# Altium schematic sheet HKCV4.SchDoc
size 459 x 271 mm; Origin: Eagle; OriginPath: \\wsl.localhost\Ubuntu-24.04\home\jverga\Helium_Electronics\3phase_integrated-master\New Version\Cheetah Driver Integrated V4\HKCV4.sch; OriginSheet: 1
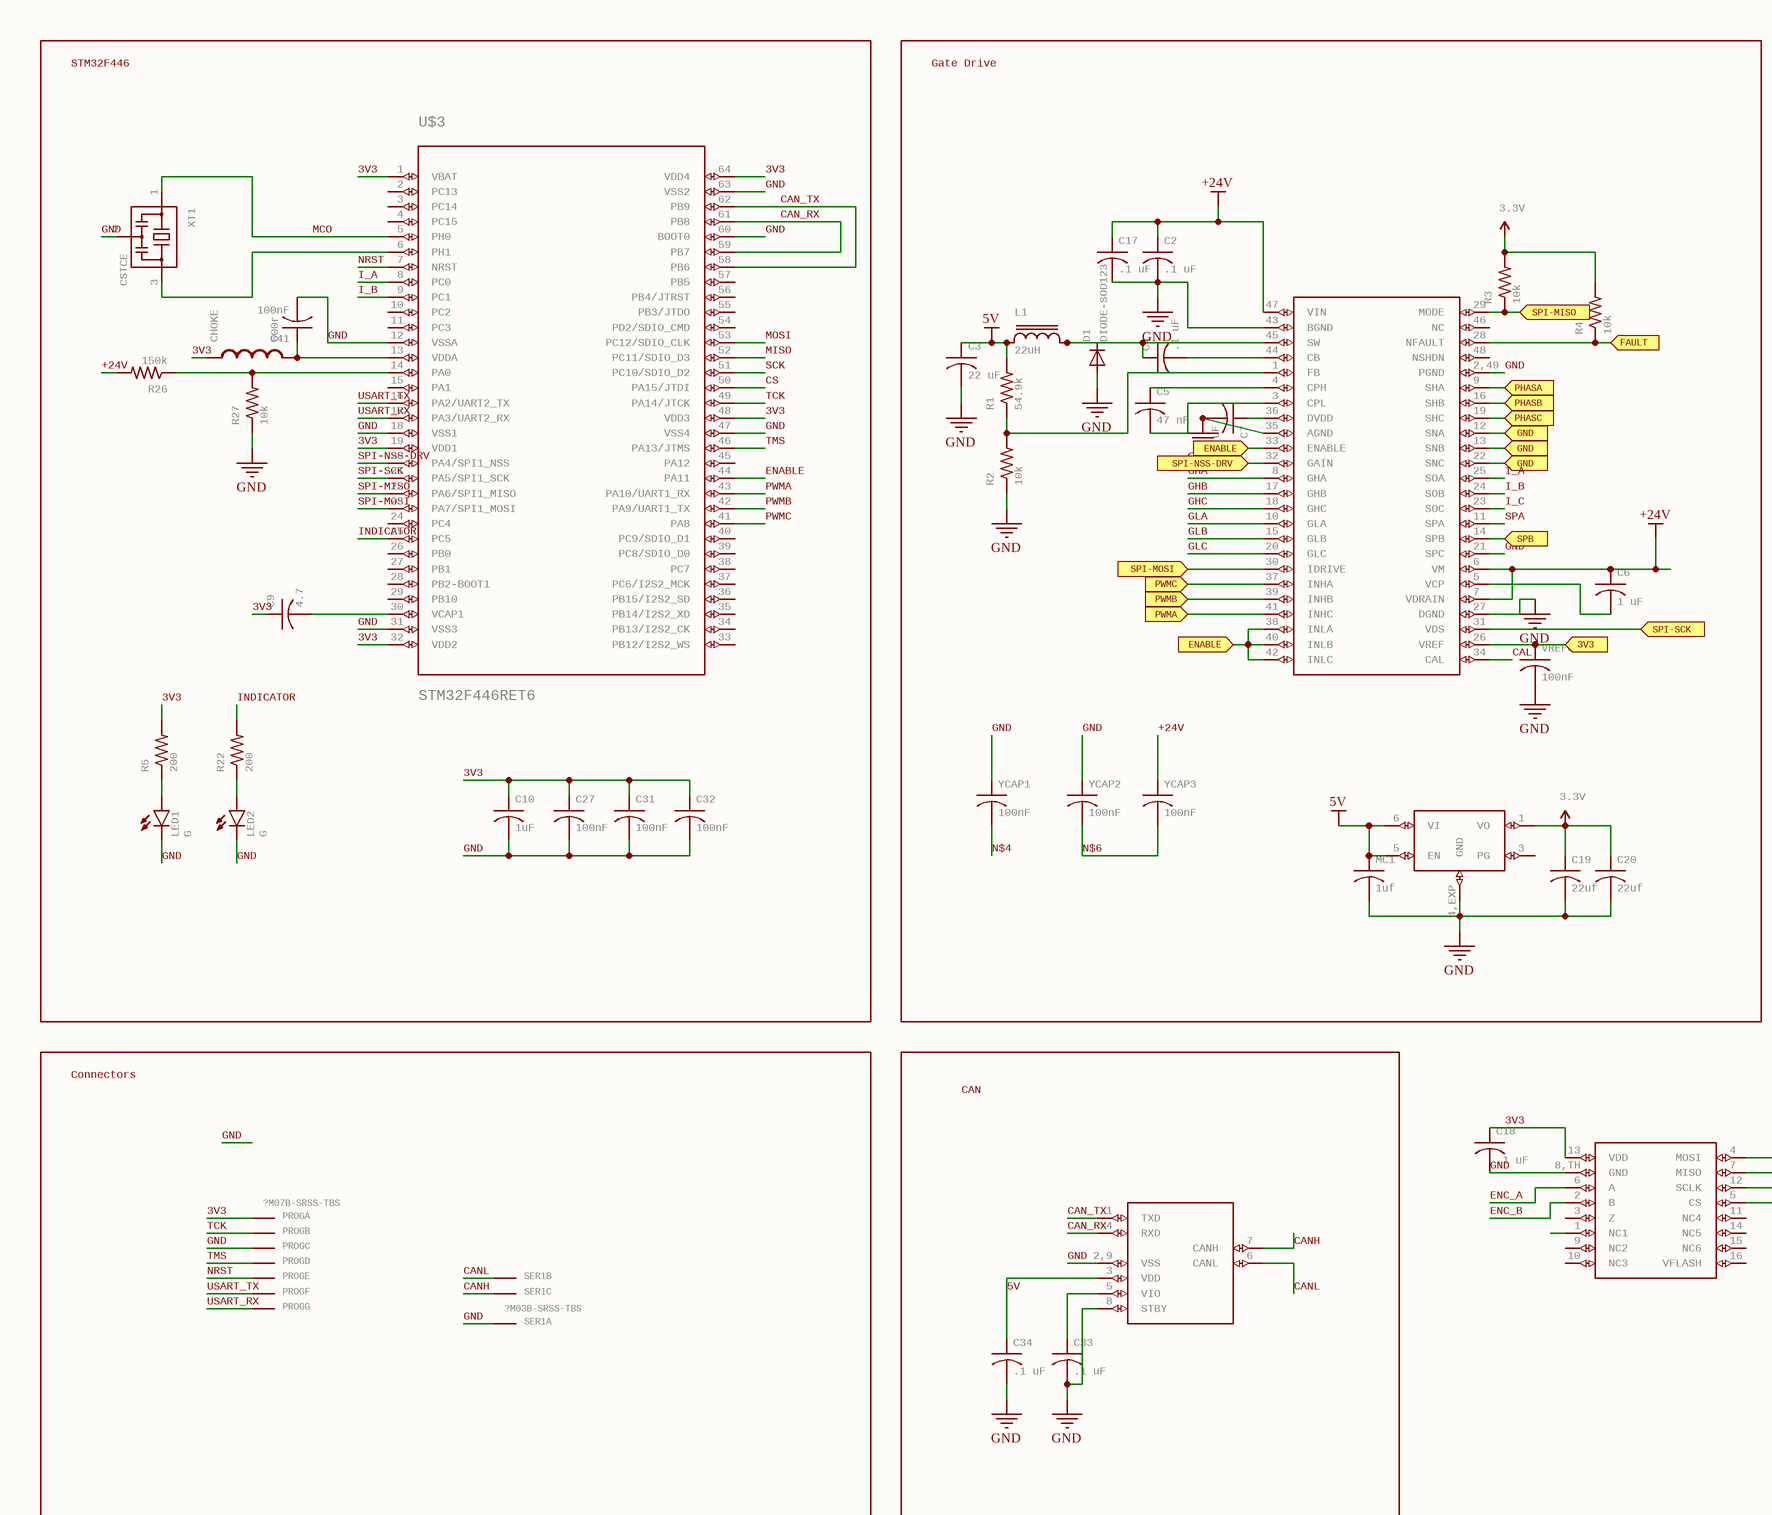
[diagram p0: HKCV4.SchDoc, left]
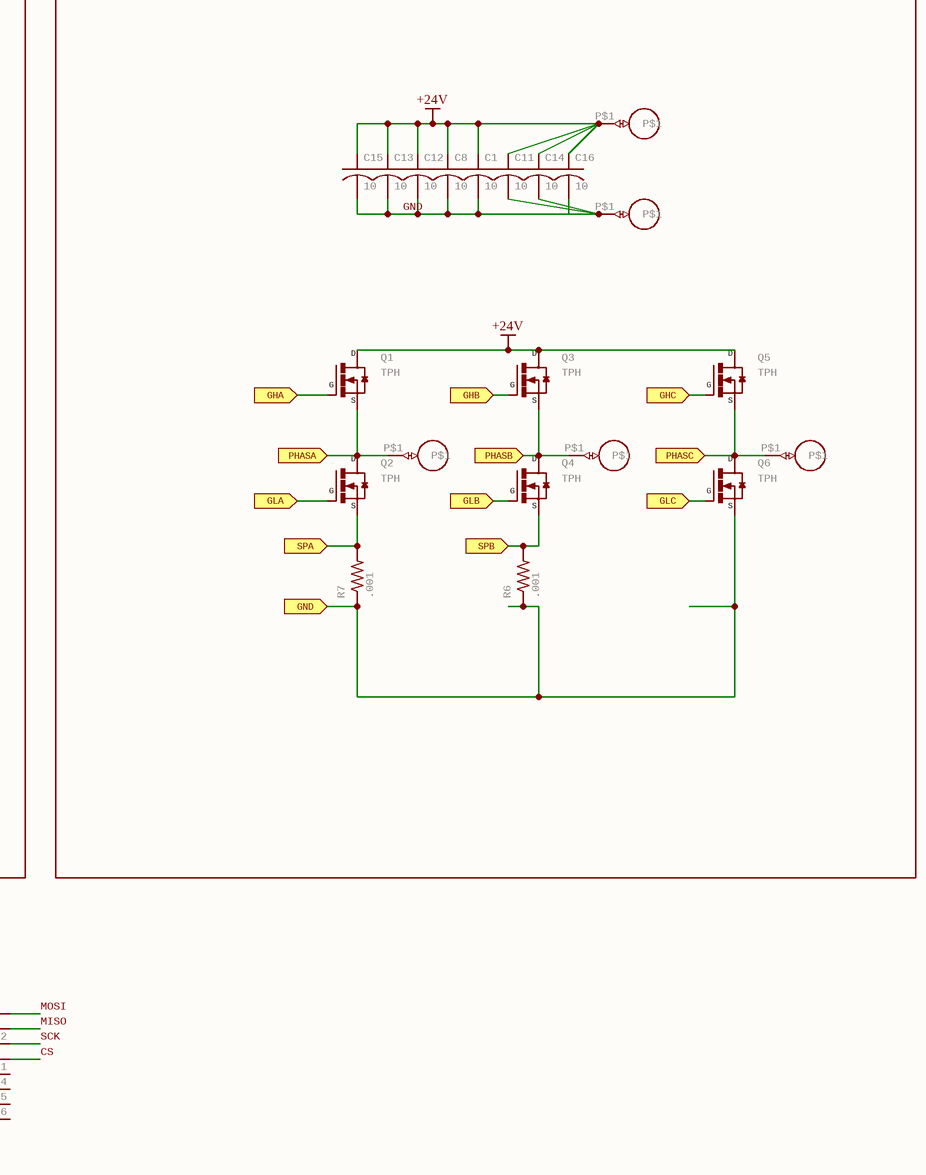
[diagram p1: HKCV4.SchDoc, right]

## Parts
C1  10  [C1206K]
C2  .1 uF  [C0603K]
C3  22 uF  [C0603K]
C4  .1 uF  [C0603K]
C5  47 nF  [C0402K]
C6  1 uF  [C0603K]
C7  1 uF  [C0402K]
C8  10  [C1206K]
C9  4.7  [C0402K]
C10  1uF  [C0402K]
C11  10  [C1206K]
C12  10  [C1206K]
C13  10  [C1206K]
C14  10  [C1206K]
C15  10  [C1206K]
C16  10  [C1206K]
C17  .1 uF  [C1206K]
C18  .1 uF  [C0402K]
C19  22uf  [C0603K]
C20  22uf  [C0603K]
C27  100nF  [C0402K]
C31  100nF  [C0402K]
C32  100nF  [C0402K]
C33  .1 uF  [C0402K]
C34  .1 uF  [C0402K]
C41  100nF  [C0402]
CHOKE  600r  [0603]
D1  DIODE-SOD123  [SOD123]
L1  22uH  [SDR0302]
LED1  G  [LED-0603]
LED2  G  [LED-0603]
MC1  1uf  [C0402]
PROG  ?M07B-SRSS-TBS  [SM07B-SRSS-TB]  (parts A,B,C,D,E,F,G of 7)
Q1  TPH  [TRANS_TPH5900CNH,L1Q]
Q2  TPH  [TRANS_TPH5900CNH,L1Q]
Q3  TPH  [TRANS_TPH5900CNH,L1Q]
Q4  TPH  [TRANS_TPH5900CNH,L1Q]
Q5  TPH  [TRANS_TPH5900CNH,L1Q]
Q6  TPH  [TRANS_TPH5900CNH,L1Q]
R1  54.9k  [R0402]
R2  10k  [R0402]
R3  10k  [R0402]
R4  10k  [R0402]
R5  200  [R0402]
R6  .001  [R1210]
R7  .001  [R1210]
R22  200  [R0402]
R26  150k  [R0402]
R27  10k  [R0402]
SER1  ?M03B-SRSS-TBS  [SM03B-SRSS-TB]  (parts A,B,C of 3)
SUPPLY1  3.3V
SUPPLY2  3.3V
U$1  DRV8323RH  [QFN50P700X700X90-49N]  (value not drawn)
U$2  18_AWG_PAD  [18_AWG_PAD]  (value not drawn)
U$3  STM32F446RET6  [TQFP64]
U$4  18_AWG_PAD  [18_AWG_PAD]  (value not drawn)
U$5  18_AWG_PAD  [18_AWG_PAD]  (value not drawn)
U$6  MCP2542  [TDFN]  (value not drawn)
U$7  LDFM  [DFN6-3X3]  (value not drawn)
U$8  18_AWG_PAD  [18_AWG_PAD]  (value not drawn)
U$10  18_AWG_PAD  [18_AWG_PAD]  (value not drawn)
U$11  MA700  [QFN16]  (value not drawn)
VREFCAP  100nF  [C0402K]
XT1  CSTCE  [CSTCE]
YCAP1  100nF  [C0402K]
YCAP2  100nF  [C0402K]
YCAP3  100nF  [C0402K]

## Blocks framed on the sheet
STM32F446: C9 C10 C27 C31 C32 C41 CHOKE LED1 LED2 R5 R22 R26 R27 U$3 XT1
Gate Drive: C2-C7 C17 C19 C20 D1 L1 MC1 R1-R4 SUPPLY1 SUPPLY2 U$1 U$7 VREFCAP YCAP1-YCAP3
Connectors: PROG SER1
CAN: C33 C34 U$6

## Ports
3V3 (in), ENABLE (in), FAULT (in), GHA (in), GHB (in), GHC (in), GLA (in), GLB (in), GLC (in), GND (in), PHASA (in), PHASB (in), PHASC (in), PWMA (in), PWMB (in), PWMC (in), SPA (in), SPB (in), SPI-MISO (in), SPI-MOSI (in), SPI-NSS-DRV (in), SPI-SCK (in)

## Nets
5V: C3.1 C34.1 L1.1 MC1.1 R1.2 U$6.3(VDD) U$7.5(EN) U$7.6(VI)
+24V: C1.1 C2.1 C6.1 C8.1 C11.1 C12.1 C13.1 C14.1 C15.1 C16.1 C17.1 Q1.5,6,7,8,EP(D) Q3.5,6,7,8,EP(D) Q5.5,6,7,8,EP(D) R26.2 U$1.6(VM) U$1.7(VDRAIN) U$1.47(VIN) U$8.P$1 YCAP3.1
GND: C1.2 C2.2 C3.2 C7.2 C8.2 C10.2 C11.2 C12.2 C13.2 C14.2 C15.2 C16.2 C17.2 C18.2 C19.2 C20.2 C27.2 C31.2 C32.2 C33.2 C34.2 C41.2 D1.A LED1.C LED2.C MC1.2 PROG.3(S) R2.1 R27.1 SER1.1(S) U$1.2,49(PGND) U$1.21(SPC) U$1.27(DGND) U$1.35(AGND) U$1.43(BGND) U$3.12(VSSA) U$3.18(VSS1) U$3.31(VSS3) U$3.47(VSS4) U$3.60(BOOT0) U$3.63(VSS2) U$6.2,9(VSS) U$6.8(STBY) U$7.4,EXP(GND) U$10.P$1 U$11.8,TH(GND) VREFCAP.2 XT1.2 YCAP1.1 YCAP2.1
3V3: U$1.26(VREF) VREFCAP.1 ; port 3V3
3V3: C9.1 C10.1 C18.1 C27.1 C31.1 C32.1 CHOKE.1 PROG.1(S) R5.2 U$3.1(VBAT) U$3.19(VDD1) U$3.32(VDD2) U$3.48(VDD3) U$3.64(VDD4) U$11.13(VDD)  [a separate net that carries the same name]
CAL: U$1.34(CAL)
CAN_RX: U$3.59(PB7) U$3.61(PB8) U$6.4(RXD)
CAN_TX: U$3.58(PB6) U$3.62(PB9) U$6.1(TXD)
CANH: SER1.3(S) U$6.7(CANH)
CANL: SER1.2(S) U$6.6(CANL)
CS: U$3.50(PA15/JTDI) U$11.5(CS)
ENABLE: U$1.33(ENABLE) U$1.38(INLA) U$1.40(INLB) U$1.42(INLC) ; port ENABLE
ENABLE: U$3.44(PA11)  [a separate net that carries the same name]
ENC_A: U$11.6(A)
ENC_B: U$11.2(B)
FAULT: R4.1 U$1.28(NFAULT) ; port FAULT
GHA: U$1.8(GHA)
GHA: Q1.4(G) ; port GHA  [a separate net that carries the same name]
GHB: U$1.17(GHB)
GHB: Q3.4(G) ; port GHB  [a separate net that carries the same name]
GHC: U$1.18(GHC)
GHC: Q5.4(G) ; port GHC  [a separate net that carries the same name]
GLA: U$1.10(GLA)
GLA: Q2.4(G) ; port GLA  [a separate net that carries the same name]
GLB: U$1.15(GLB)
GLB: Q4.4(G) ; port GLB  [a separate net that carries the same name]
GLC: U$1.20(GLC)
GLC: Q6.4(G) ; port GLC  [a separate net that carries the same name]
GND: Q6.1-3(S) R6.1 R7.1 U$1.12(SNA) U$1.13(SNB) U$1.22(SNC) ; port GND  [a separate net that carries the same name]
I_A: U$1.25(SOA) U$3.8(PC0)
I_B: U$1.24(SOB) U$3.9(PC1)
I_C: U$1.23(SOC)
INDICATOR: R22.2 U$3.25(PC5)
MCO: U$3.5(PH0) XT1.1
MISO: U$3.52(PC11/SDIO_D3) U$11.7(MISO)
MOSI: U$3.53(PC12/SDIO_CLK) U$11.4(MOSI)
N$4: YCAP1.2
N$6: YCAP2.2 YCAP3.2
NRST: PROG.5(S) U$3.7(NRST)
PHASA: Q1.1-3(S) Q2.5,6,7,8,EP(D) U$1.9(SHA) U$4.P$1 ; port PHASA
PHASB: Q3.1-3(S) Q4.5,6,7,8,EP(D) U$1.16(SHB) U$2.P$1 ; port PHASB
PHASC: Q5.1-3(S) Q6.5,6,7,8,EP(D) U$1.19(SHC) U$5.P$1 ; port PHASC
PWMA: U$1.41(INHC) ; port PWMA
PWMA: U$3.43(PA10/UART1_RX)  [a separate net that carries the same name]
PWMB: U$1.39(INHB) ; port PWMB
PWMB: U$3.42(PA9/UART1_TX)  [a separate net that carries the same name]
PWMC: U$1.37(INHA) ; port PWMC
PWMC: U$3.41(PA8)  [a separate net that carries the same name]
SCK: U$3.51(PC10/SDIO_D2) U$11.12(SCLK)
SPA: U$1.11(SPA)
SPA: Q2.1-3(S) R7.2 ; port SPA  [a separate net that carries the same name]
SPB: Q4.1-3(S) R6.2 U$1.14(SPB) ; port SPB
SPI-MISO: R3.1 U$1.29(MODE) ; port SPI-MISO
SPI-MISO: U$3.22(PA6/SPI1_MISO)  [a separate net that carries the same name]
SPI-MOSI: U$1.30(IDRIVE) ; port SPI-MOSI
SPI-MOSI: U$3.23(PA7/SPI1_MOSI)  [a separate net that carries the same name]
SPI-NSS-DRV: U$1.32(GAIN) ; port SPI-NSS-DRV
SPI-NSS-DRV: U$3.20(PA4/SPI1_NSS)  [a separate net that carries the same name]
SPI-SCK: U$1.31(VDS) ; port SPI-SCK
SPI-SCK: U$3.21(PA5/SPI1_SCK)  [a separate net that carries the same name]
TCK: PROG.2(S) U$3.49(PA14/JTCK)
TMS: PROG.4(S) U$3.46(PA13/JTMS)
USART_RX: PROG.7(S) U$3.17(PA3/UART2_RX)
USART_TX: PROG.6(S) U$3.16(PA2/UART2_TX)
NetC4_1: C4.1 D1.C L1.2 U$1.45(SW)
NetC4_2: C4.2 U$1.44(CB)
NetC5_1: C5.1 U$1.4(CPH)
NetC5_2: C5.2 U$1.3(CPL)
NetC6_2: C6.2 U$1.5(VCP)
NetC7_1: C7.1 U$1.36(DVDD)
NetC9_2: C9.2 U$3.30(VCAP1)
NetC19_1: C19.1 C20.1 SUPPLY2.?1(3.3V) U$7.1(VO)
NetC33_1: C33.1 U$6.5(VIO)
NetC41_1: C41.1 CHOKE.2 U$3.13(VDDA)
NetLED1_A: LED1.A R5.1
NetLED2_A: LED2.A R22.1
NetR1_1: R1.1 R2.2 U$1.1(FB)
NetR3_2: R3.2 R4.2 SUPPLY1.?1(3.3V)
NetR26_1: R26.1 R27.2 U$3.14(PA0)
NetU$3_6: U$3.6(PH1) XT1.3

Not connected (* = marked no-connect by the designer): U$1 46(NC) 48(NSHDN); U$3 2(PC13) 3(PC14) 4(PC15) 10(PC2) 11(PC3) 15(PA1) 24(PC4) 26(PB0) 27(PB1) 28(PB2-BOOT1) 29(PB10) 33(PB12/I2S2_WS) 34(PB13/I2S2_CK) 35(PB14/I2S2_XD) 36(PB15/I2S2_SD) 37(PC6/I2S2_MCK) 38(PC7) 39(PC8/SDIO_D0) 40(PC9/SDIO_D1) 45(PA12) 54(PD2/SDIO_CMD) 55(PB3/JTDO) 56(PB4/JTRST) 57(PB5); U$7 3(PG); U$11 1(NC1) 3(Z) 9(NC2) 10(NC3) 11(NC4) 14(NC5) 15(NC6) 16(VFLASH)

## Library data of the parts
C1 C8 C11-C17 = C-USC1206K: CAPACITOR, American symbol; GateName_1: G$1; SymbolName_1: C-US; DeviceName: C1206K; LibraryName: rcl; DeviceSetName: C-US
C2-C4 C6 C19 C20 = C-USC0603K: CAPACITOR, American symbol; GateName_1: G$1; SymbolName_1: C-US; DeviceName: C0603K; LibraryName: rcl; DeviceSetName: C-US
C5 C7 C9 C10 C18 C27 C31-C34 VREFCAP YCAP1-YCAP3 = C-USC0402K: CAPACITOR, American symbol; GateName_1: G$1; SymbolName_1: C-US; DeviceName: C0402K; LibraryName: rcl; DeviceSetName: C-US
C41 MC1 = C-USC0402: CAPACITOR, American symbol; GateName_1: G$1; SymbolName_1: C-US; DeviceName: C0402; LibraryName: rcl; DeviceSetName: C-US
CHOKE = INDUCTOR0603: Inductors   Basic Inductor/Choke - 0603 and 1206. Footprints are not proven and vary greatly between part numbers. INDUCTOR POWER 3.3UH 4.0A SMD 0.197" L x 0.197" W x 0.177" H (5.00mm x 5.00mm x 4.50mm); GateName_1: G$1; SymbolName_1: INDUCTOR; DeviceName: 0603; LibraryName: SparkFun-Passives; DeviceSetName: INDUCTOR
D1 = DIODE-SOD123: DIODE; GateName_1: G$1; SymbolName_1: D; DeviceSetName: DIODE-; DeviceName: SOD123; LibraryName: diode
L1 = SDR0302: POWER INDUCTOR; GateName_1: G$1; SymbolName_1: L; LibraryName: inductor-bourns; DeviceSetName: SDR0302
LED1 LED2 = LED0603: LEDsStandard schematic elements and footprints for 5mm, 3mm, 1206, and 0603 sized LEDs. 5mm - Spark Fun Electronics SKU : COM-00529 (and others); GateName_1: G$1; SymbolName_1: LED; DeviceName: 0603; LibraryName: SparkFun-LED; DeviceSetName: LED
PROG = ?M07B-SRSS-TBS: Disconnectable Crimp style connector, 1.0mm pitch 7 contacts; GateName_1: -1; SymbolName_1: KV; GateName_2: -2; SymbolName_2: K; GateName_3: -3; GateName_4: -4; GateName_5: -5; GateName_6: -6; GateName_7: -7; DeviceName: S; SymbolName_3: K; SymbolName_4: K; SymbolName_5: K; SymbolName_6: K; SymbolName_7: K; LibraryName: con-jst2; DeviceSetName: ?M07B-SRSS-TB
Q1-Q6 = TPH: GateName_1: G$1; SymbolName_1: MOSFET_N; LibraryName: transistor-power; DeviceSetName: TPH; D: D; S: S; G: G
R1-R5 R22 R26 R27 = R-US_R0402: RESISTOR, American symbol; GateName_1: G$1; SymbolName_1: R-US; DeviceSetName: R-US_; DeviceName: R0402; LibraryName: rcl
R6 R7 = R-US_R1210: RESISTOR, American symbol; GateName_1: G$1; SymbolName_1: R-US; DeviceSetName: R-US_; DeviceName: R1210; LibraryName: rcl
SER1 = ?M03B-SRSS-TBS: Disconnectable Crimp style connector, 1.0mm pitch 3 contacts; GateName_1: -1; SymbolName_1: KV; GateName_2: -2; SymbolName_2: K; GateName_3: -3; DeviceName: S; SymbolName_3: K; LibraryName: con-jst2; DeviceSetName: ?M03B-SRSS-TB
SUPPLY1 SUPPLY2 = 3.3V: SUPPLY SYMBOL; GateName_1: G$1; SymbolName_1: 3.3V; LibraryName: SparkFun-Aesthetics; DeviceSetName: 3.3V
U$1 = DRV8323RH: GateName_1: G$1; SymbolName_1: DRV8323RH; LibraryName: BenLibrary; DeviceSetName: DRV8323RH
U$2 U$4 U$5 U$8 U$10 = 18_AWG_PAD: GateName_1: G$1; SymbolName_1: 18_AWG_PAD; LibraryName: BenLibrary; DeviceSetName: 18_AWG_PAD
U$3 = STM32F446RET6: ARM DSP Chip used on the WAV Trigger board.; GateName_1: G$1; SymbolName_1: STM32F405RG; LibraryName: BenLibrary; DeviceSetName: STM32F446RET6
U$6 = MCP2542: GateName_1: G$1; SymbolName_1: MCP2542; LibraryName: BenLibrary; DeviceSetName: MCP2542
U$7 = LDFM: GateName_1: G$1; SymbolName_1: LDFM; LibraryName: BenLibrary; DeviceSetName: LDFM
U$11 = MA700: GateName_1: G$1; SymbolName_1: MA700; LibraryName: BenLibrary; DeviceSetName: MA700
XT1 = CSTCE: GateName_1: G$1; SymbolName_1: CST; LibraryName: sc_usercreated; DeviceSetName: CSTCE